# Altium schematic sheet Encoder.SchDoc
size A4; SheetNumber: 6; SheetTotal: 7
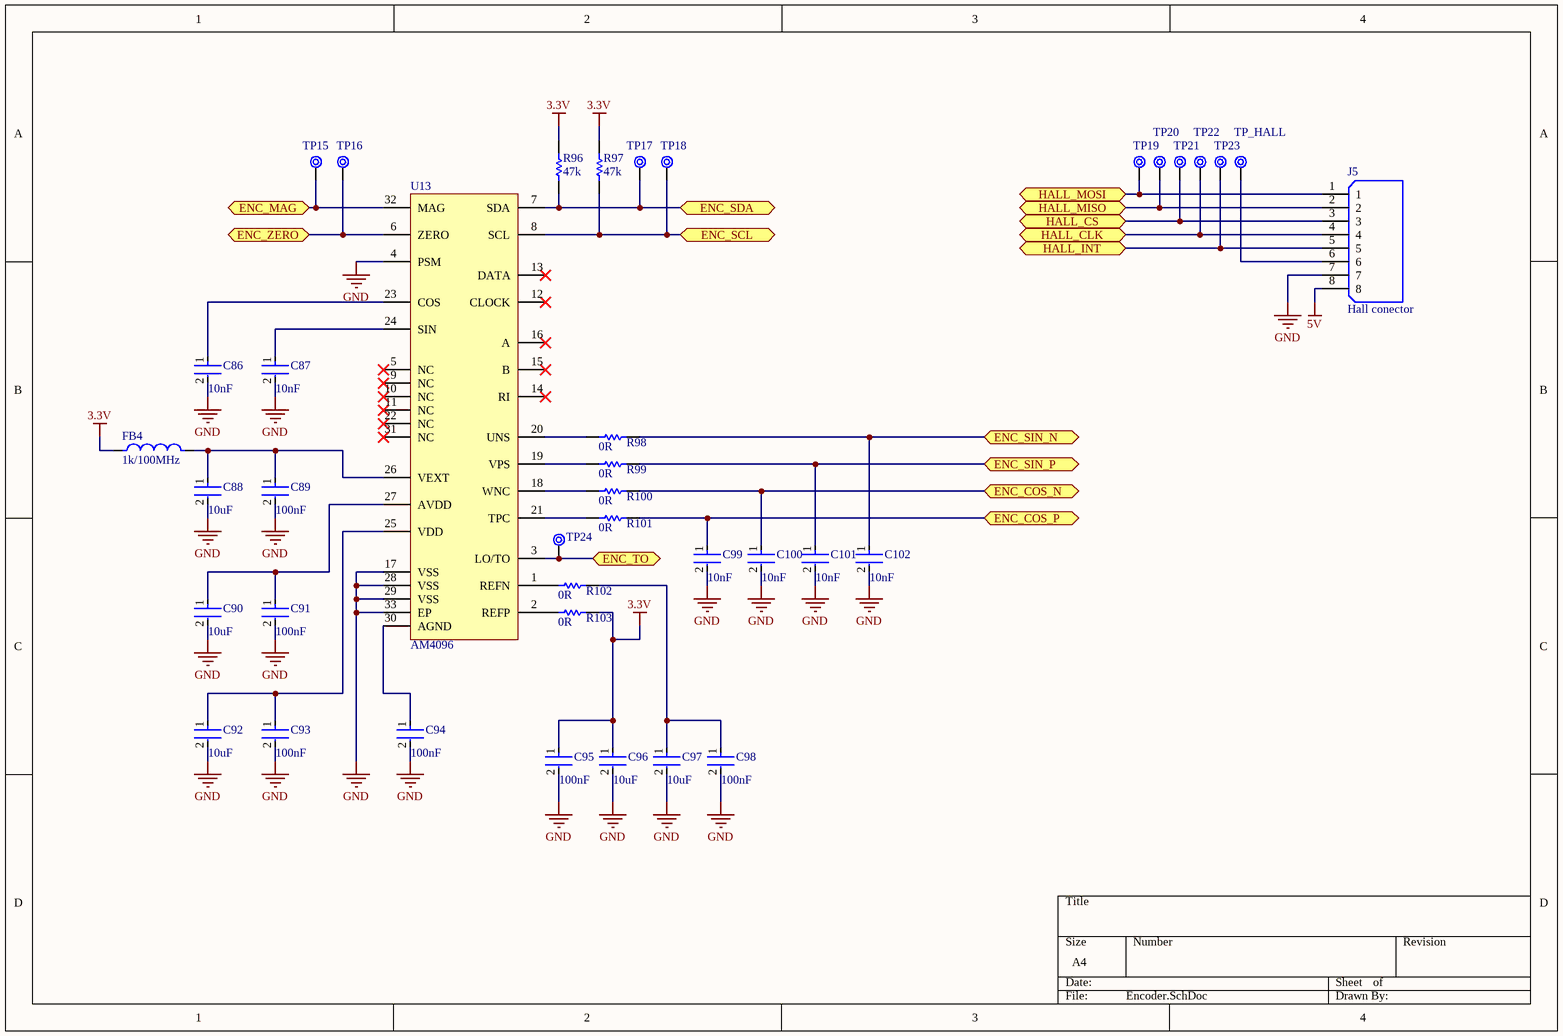
[diagram p0: Encoder.SchDoc]

## Parts
C86  10nF  [FP-C0805C-DN-MFG]
C87  10nF  [FP-C0805C-DN-MFG]
C88  10uF  [FP-C0805C-DN-MFG]
C89  100nF  [FP-C0805C-DN-MFG]
C90  10uF  [FP-C0805C-DN-MFG]
C91  100nF  [FP-C0805C-DN-MFG]
C92  10uF  [FP-C0805C-DN-MFG]
C93  100nF  [FP-C0805C-DN-MFG]
C94  100nF  [FP-C0805C-DN-MFG]
C95  100nF  [FP-C0805C-DN-MFG]
C96  10uF  [FP-C0805C-DN-MFG]
C97  10uF  [FP-C0805C-DN-MFG]
C98  100nF  [FP-C0805C-DN-MFG]
C99  10nF  [FP-C0805C-DN-MFG]
C100  10nF  [FP-C0805C-DN-MFG]
C101  10nF  [FP-C0805C-DN-MFG]
C102  10nF  [FP-C0805C-DN-MFG]
FB4  1k/100MHz  [FB_0603]
J5  Hall conector  [AMPHENOL_10114830-11108LF]
R96  47k  [RESC2013X50X30LL20T20]
R97  47k  [RESC2013X50X30LL20T20]
R98  0R  [RESC1609X50X30NL8T20]
R99  0R  [RESC1609X50X30NL8T20]
R100  0R  [RESC1609X50X30NL8T20]
R101  0R  [RESC1609X50X30NL8T20]
R102  0R  [RESC1609X50X30NL8T20]
R103  0R  [RESC1609X50X30NL8T20]
TP15  Test Point 1mm  [Pad 1mm]  (value not drawn)
TP16  Test Point 1mm  [Pad 1mm]  (value not drawn)
TP17  Test Point 1mm  [Pad 1mm]  (value not drawn)
TP18  Test Point 1mm  [Pad 1mm]  (value not drawn)
TP19  Test Point 1mm  [Pad 1mm]  (value not drawn)
TP20  Test Point 1mm  [Pad 1mm]  (value not drawn)
TP21  Test Point 1mm  [Pad 1mm]  (value not drawn)
TP22  Test Point 1mm  [Pad 1mm]  (value not drawn)
TP23  Test Point 1mm  [Pad 1mm]  (value not drawn)
TP24  Test Point 1mm  [Pad 1mm]  (value not drawn)
TP_HALL  Test Point 1mm  [Pad 1mm]  (value not drawn)
U13  AM4096  [QFN65P600X600X100_HS-33N]

## Ports
ENC_COS_N (bidir, see MCU[7B]), ENC_COS_P (bidir, see MCU[7B]), ENC_MAG (bidir, see MCU[5B]), ENC_SCL (bidir, see MCU[5B]), ENC_SDA (bidir, see MCU[7B]), ENC_SIN_N (bidir, see MCU[7A]), ENC_SIN_P (bidir, see MCU[7A]), ENC_TO (bidir, see MCU[7A]), ENC_ZERO (bidir, see MCU[5A]), HALL_CLK (bidir, see MCU[5A]), HALL_CS (bidir, see MCU[7A]), HALL_INT (bidir, see MCU[7B]), HALL_MISO (bidir, see MCU[5A]), HALL_MOSI (bidir, see MCU[5B])

## Nets
3.3V: C95.1 C96.1 FB4.1 R96.2 R97.2 R103.2
5V: J5.8
GND: C86.2 C87.2 C88.2 C89.2 C90.2 C91.2 C92.2 C93.2 C94.2 C95.2 C96.2 C97.2 C98.2 C99.2 C100.2 C101.2 C102.2 J5.7 U13.4(PSM) U13.17(VSS) U13.28(VSS) U13.29(VSS) U13.33(EP)
ENC_COS_N: C100.1 R100.2 ; port ENC_COS_N
ENC_COS_P: C99.1 R101.2 ; port ENC_COS_P
ENC_MAG: TP15.1 U13.32(MAG) ; port ENC_MAG
ENC_SCL: R97.1 TP18.1 U13.8(SCL) ; port ENC_SCL
ENC_SDA: R96.1 TP17.1 U13.7(SDA) ; port ENC_SDA
ENC_SIN_N: C102.1 R98.2 ; port ENC_SIN_N
ENC_SIN_P: C101.1 R99.2 ; port ENC_SIN_P
ENC_TO: TP24.1 U13.3(LO/TO) ; port ENC_TO
ENC_ZERO: TP16.1 U13.6(ZERO) ; port ENC_ZERO
HALL_CLK: J5.4 TP22.1 ; port HALL_CLK
HALL_CS: J5.3 TP21.1 ; port HALL_CS
HALL_INT: J5.5 TP23.1 ; port HALL_INT
HALL_MISO: J5.2 TP20.1 ; port HALL_MISO
HALL_MOSI: J5.1 TP19.1 ; port HALL_MOSI
NetC86_1: C86.1 U13.23(COS)
NetC87_1: C87.1 U13.24(SIN)
NetC88_1: C88.1 C89.1 FB4.2 U13.26(VEXT)
NetC90_1: C90.1 C91.1 U13.27(AVDD)
NetC92_1: C92.1 C93.1 U13.25(VDD)
NetC94_1: C94.1 U13.30(AGND)
NetC97_1: C97.1 C98.1 R102.2
NetJ5_6: J5.6 TP_HALL.1
NetR98_1: R98.1 U13.20(UNS)
NetR99_1: R99.1 U13.19(VPS)
NetR100_1: R100.1 U13.18(WNC)
NetR101_1: R101.1 U13.21(TPC)
NetR102_1: R102.1 U13.1(REFN)
NetR103_1: R103.1 U13.2(REFP)

Not connected (* = marked no-connect by the designer): U13 5(NC)* 9(NC)* 10(NC)* 11(NC)* 12(CLOCK)* 13(DATA)* 14(RI)* 15(B)* 16(A)* 22(NC)* 31(NC)*

## Library data of the parts
C86-C102 = CMP-2007-00279-2: CAP CER 0.1UF 50V X7R 0805; Manufacturer Part Number: C0805C104K5RACTU; Manufacturer: KEMET; Value: 0.10 μF; Tolerance: 0.1; Temperature Coefficient: 30ppm/°C; Material: Ceramic; Device Class L2: Capacitors; Temperature Range Low: -55°C; Voltage Rating: 50 V; Digikey Description: CAP CER 0.1UF 50V X7R 0805; Category: Cap; ComponentLink2Description: Datasheet; Octopart: https://octopart.com/c0805c104k5ractu-kemet-143926; RoHS: TRUE; ComponentLink2URL: https://content.kemet.com/datasheets/KEM_C1003_C0G_SMD.pdf; Temperature Characteristic: X7R; Temperature: -55°C to +125°C; Height: 0.88mm; Temperature Range High: +125°C; Device Class L1: Passive Components; Automotive: No; Lead Free: Yes; Ipc Land Pattern Name: CAPC200125X78; Device Class L3: Ceramic Capacitors; Mouser Description: Cap Ceramic 0.1uF 50V X7R 10% SMD 2.0 x 1.2 mm 125 C Paper T/R; Capacitance: 0.10 μF; Package: C0805C-DN
FB4 = FB/MMZ1608B102CTA00: Ferrite Beads 1K OHM 25%; Manufacturer: TDK; Distributor: Mouser; Distributor ID: 810-MMZ1608B102CTA00; Part Number: MMZ1608B102CTA00
J5 = 10114830-11108LF: 1.25mm Wire to Board Wafer, Right Angle, Surface Mount, 8 Positions; MF: Amphenol ICC; Package: None; Price: None; Check_prices: https://www.snapeda.com/parts/10114830-11108LF/Amphenol+FCI/view-part/?ref=eda; Value: *; SnapEDA_Link: https://www.snapeda.com/parts/10114830-11108LF/Amphenol+FCI/view-part/?ref=snap; MP: 10114830-11108LF; Availability: In Stock; Purchase-URL: https://pricing.snapeda.com/search?q=10114830-11108LF&ref=eda
R96 R97 = CMP-2001-04896-1: Manufacturer: Vishay Dale; Part Number: CRCW08050000Z0EA
R98-R103 = CMP-2000-03816-5: Chip Resistor, 0 Ohm, Jumper, 100 mW, -55 to 155 degC, 0603 (1608 Metric), RoHS, Tape and Reel; Manufacturer: Vishay Semiconductor; Voltage Rating: 75 V; Package Quantity: 5000; DatasheetVersion: 06/2012; Min Operating Temperature: -55 degC; ComponentLink1URL: http://www.vishay.com/; Mounting Technology: Surface Mount; Height: 0.45 mm; ComponentLink1Description: Manufacturer URL; REACH SVHC: Unknown; PackageReference: 0603; Packaging: Tape and Reel; Max Operating Temperature: 155 degC; Mount: Surface Mount; ComponentLink2Description: Datasheet; PackageDescription: 2-Pin Surface Mount Device, Body 1.575 x 0.85 mm; Length: 1.55 mm; ComponentLink2URL: http://www.vishay.com/docs/20035/dcrcwe3.pdf; Pins: 2; RoHSCompliant: true
U13 = AM4096: 12 bit Rotary Magnetic Encoder IC; Manufacturer: RLS; Distributor: RLS; Distributor ID: AM4096; Part Number: AM4096